# Altium schematic sheet Microcontroller.SchDoc
size 279 x 215 mm; Author: Riley Peterson; Revision: 0; SheetNumber: 2; SheetTotal: 3
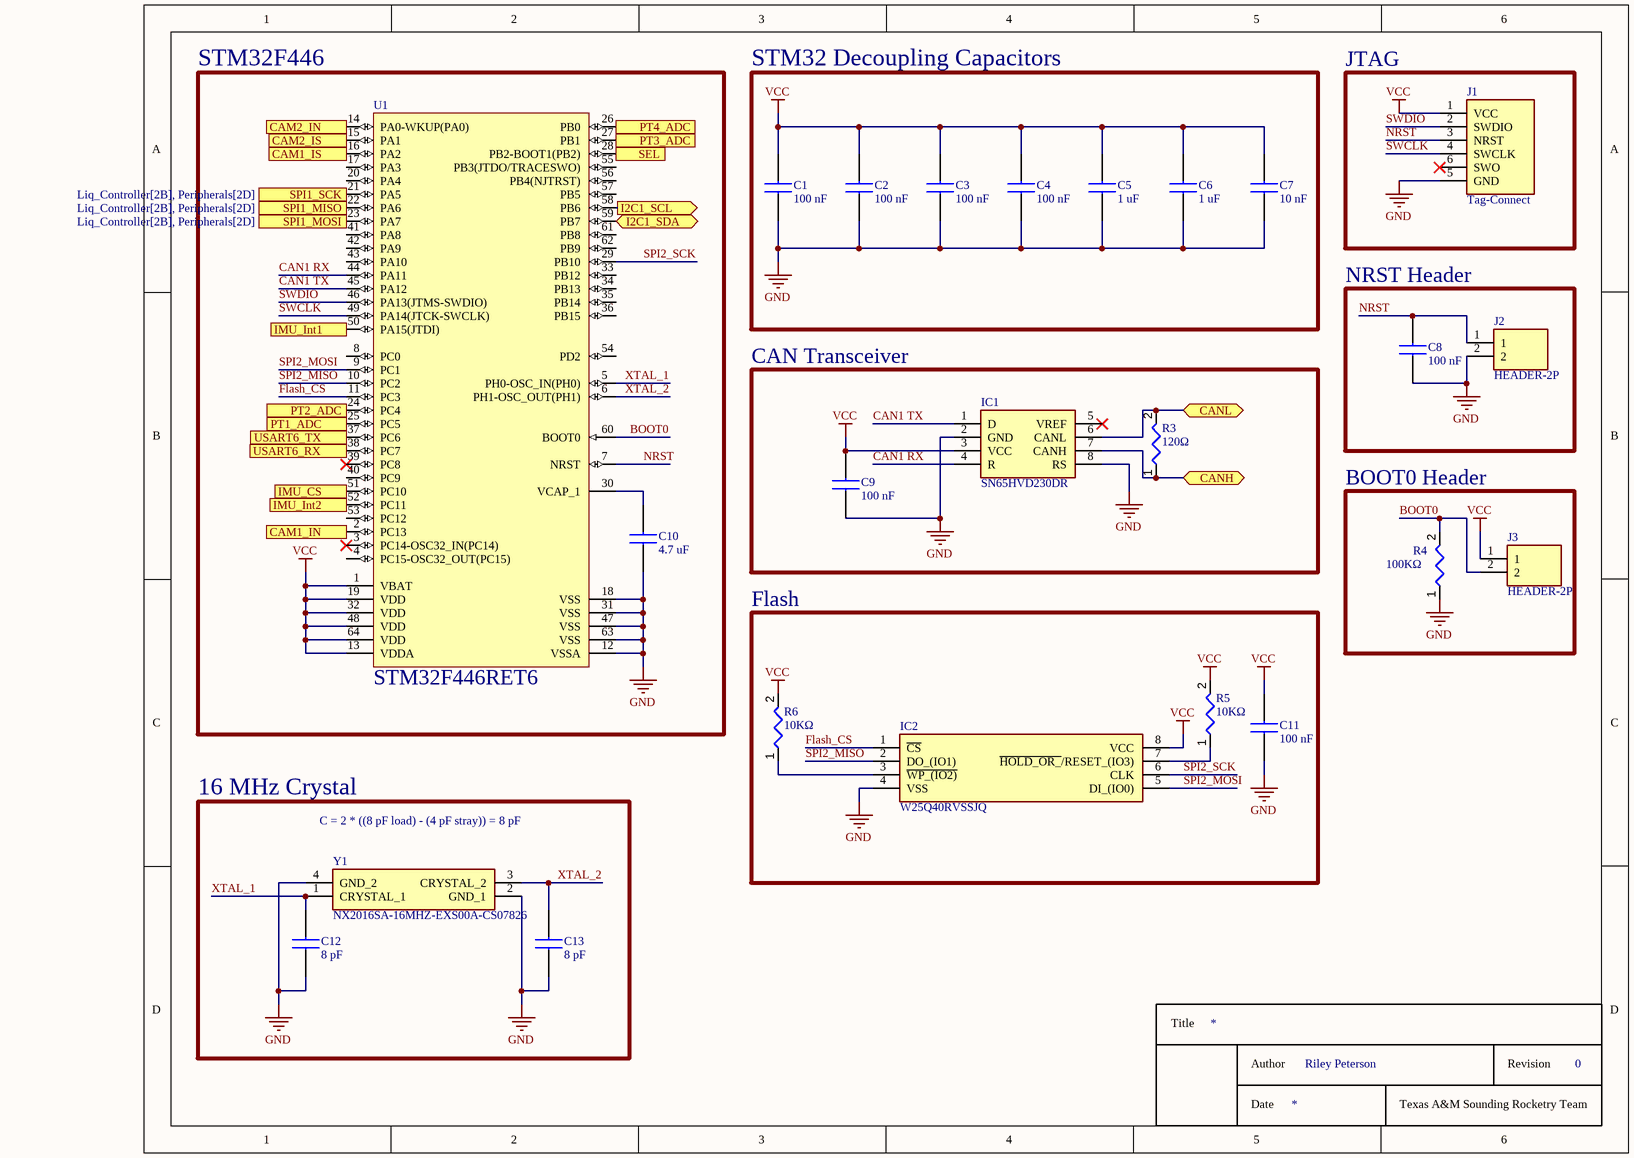
[diagram p0: Microcontroller.SchDoc]

## Parts
C1  100 nF  [CAP_0603]
C2  100 nF  [CAP_0603]
C3  100 nF  [CAP_0603]
C4  100 nF  [CAP_0603]
C5  1 uF  [CAP_0603]
C6  1 uF  [CAP_0603]
C7  10 nF  [CAP_0603]
C8  100 nF  [CAP_0603]
C9  100 nF  [CAP_0603]
C10  4.7 uF  [CAP_0603]
C11  100 nF  [CAP_0603]
C12  8 pF  [CAP_0603]
C13  8 pF  [CAP_0603]
IC1  SN65HVD230DR  [SOT127P600X175-8N]
IC2  W25Q40RVSSJQ  [SOIC127P790X216-8N]
J1  Tag-Connect  [TC2030-MCP]
J2  HEADER-2P  [HDRV2W110P0X254_1X2_508X254X854P]
J3  HEADER-2P  [HDRV2W110P0X254_1X2_508X254X854P]
R3  120Ω  [RES_0603]
R4  100KΩ  [RES_0603]
R5  10KΩ  [RES_0603]
R6  10KΩ  [RES_0603]
U1  STM32F446RET6  [QFP50P1200X1200X160-64N]
Y1  NX2016SA-16MHZ-EXS00A-CS07826  [NX2016SA16MHZEXS00ACS07826]

## Blocks framed on the sheet
STM32F446: C10 U1
STM32 Decoupling Capacitors: C1-C7
JTAG: J1
NRST Header: C8 J2
CAN Transceiver: C9 IC1 R3
BOOT0 Header: J3 R4
Flash: C11 IC2 R5 R6
16 MHz Crystal: C12 C13 Y1

## Ports
CAM1_IN (out), CAM1_IS (in), CAM2_IN (out), CAM2_IS (in), CANH (bidir, see Liq_Controller[2B], Peripherals[6B]), CANL (bidir, see Liq_Controller[2B], Peripherals[6B]), I2C1_SCL (out, see Liq_Controller[2A], Peripherals[5B]), I2C1_SDA (bidir, see Liq_Controller[2A], Peripherals[5B]), IMU_CS (out, see Liq_Controller[2B], Peripherals[2D]), IMU_Int1 (in, see Liq_Controller[2B], Peripherals[2D]), IMU_Int2 (in, see Liq_Controller[2B], Peripherals[1D]), PT1_ADC (in, see Liq_Controller[2B], Peripherals[6C]), PT2_ADC (in, see Liq_Controller[2B], Peripherals[6D]), PT3_ADC (in, see Liq_Controller[2B], Peripherals[4C]), PT4_ADC (in, see Liq_Controller[2B], Peripherals[4C]), SEL (in, see Liq_Controller[2B], Peripherals[4C]), SPI1_MISO (in, see Liq_Controller[2B], Peripherals[2D]), SPI1_MOSI (out, see Liq_Controller[2B], Peripherals[2D]), SPI1_SCK (out, see Liq_Controller[2B], Peripherals[2D]), USART6_RX (in, see Liq_Controller[2B], Peripherals[6A]), USART6_TX (out, see Liq_Controller[2B], Peripherals[6A])

## Nets
GND: C1.1 C2.1 C3.1 C4.1 C5.1 C6.1 C7.2 C8.1 C9.1 C10.2 C11.1 C12.1 C13.1 IC1.2(GND) IC1.8(RS) IC2.4(VSS) J1.5(GND) J2.2 R4.1 U1.12(VSSA) U1.18(VSS) U1.31(VSS) U1.47(VSS) U1.63(VSS) Y1.2(GND_1) Y1.4(GND_2)
VCC: C1.2 C2.2 C3.2 C4.2 C5.2 C6.2 C7.1 C9.2 C11.2 IC1.3(VCC) IC2.8(VCC) J1.1(VCC) J3.1 R5.2 R6.2 U1.1(VBAT) U1.13(VDDA) U1.19(VDD) U1.32(VDD) U1.48(VDD) U1.64(VDD)
BOOT0: J3.2 R4.2 U1.60(BOOT0)
CAM1_IN: U1.2(PC13) ; port CAM1_IN
CAM1_IS: U1.16(PA2) ; port CAM1_IS
CAM2_IN: U1.14(PA0-WKUP(PA0)) ; port CAM2_IN
CAM2_IS: U1.15(PA1) ; port CAM2_IS
CAN1 RX: IC1.4(R) U1.44(PA11)
CAN1 TX: IC1.1(D) U1.45(PA12)
CANH: IC1.7(CANH) R3.1 ; port CANH
CANL: IC1.6(CANL) R3.2 ; port CANL
Flash_CS: IC2.1(~{CS}) U1.11(PC3)
I2C1_SCL: U1.58(PB6) ; port I2C1_SCL
I2C1_SDA: U1.59(PB7) ; port I2C1_SDA
IMU_CS: U1.51(PC10) ; port IMU_CS
IMU_Int1: U1.50(PA15(JTDI)) ; port IMU_Int1
IMU_Int2: U1.52(PC11) ; port IMU_Int2
NRST: C8.2 J1.3(NRST) J2.1 U1.7(NRST)
PT1_ADC: U1.25(PC5) ; port PT1_ADC
PT2_ADC: U1.24(PC4) ; port PT2_ADC
PT3_ADC: U1.27(PB1) ; port PT3_ADC
PT4_ADC: U1.26(PB0) ; port PT4_ADC
SEL: U1.28(PB2-BOOT1(PB2)) ; port SEL
SPI1_MISO: U1.22(PA6) ; port SPI1_MISO
SPI1_MOSI: U1.23(PA7) ; port SPI1_MOSI
SPI1_SCK: U1.21(PA5) ; port SPI1_SCK
SPI2_MISO: IC2.2(DO_(IO1)) U1.10(PC2)
SPI2_MOSI: IC2.5(DI_(IO0)) U1.9(PC1)
SPI2_SCK: IC2.6(CLK) U1.29(PB10)
SWCLK: J1.4(SWCLK) U1.49(PA14(JTCK-SWCLK))
SWDIO: J1.2(SWDIO) U1.46(PA13(JTMS-SWDIO))
USART6_RX: U1.38(PC7) ; port USART6_RX
USART6_TX: U1.37(PC6) ; port USART6_TX
XTAL_1: C12.2 U1.5(PH0-OSC_IN(PH0)) Y1.1(CRYSTAL_1)
XTAL_2: C13.2 U1.6(PH1-OSC_OUT(PH1)) Y1.3(CRYSTAL_2)
NetC10_1: C10.1 U1.30(VCAP_1)
NetIC2_3: IC2.3(~{WP_(IO2)}) R6.1
NetIC2_7: IC2.7(~{HOLD_OR_}/RESET_(IO3)) R5.1

Not connected (* = marked no-connect by the designer): IC1 5(VREF)*; J1 6(SWO)*; U1 3(PC14-OSC32_IN(PC14))* 4(PC15-OSC32_OUT(PC15)) 8(PC0) 17(PA3) 20(PA4) 33(PB12) 34(PB13) 35(PB14) 36(PB15) 39(PC8)* 40(PC9) 41(PA8) 42(PA9) 43(PA10) 53(PC12) 54(PD2) 55(PB3(JTDO/TRACESWO)) 56(PB4(NJTRST)) 57(PB5) 61(PB8) 62(PB9)

## Notes on the sheet
- C = 2 * ((8 pF load) - (4 pF stray)) = 8 pF
- Title
- Author
- Date
- Texas A&M Sounding Rocketry Team
- Revision

## Library data of the parts
C1-C4 C8 C9 = 100 nF Capacitor, 0603: Multilayer Ceramic Capacitors MLCC - SMD/SMT KGM15BR71H104JT NEW GLOBAL PN 50V 0.1uF A 581-KGM15BR71H104JT; Manufacturer 1: KYOCERA AVX; Manufacturer Part Number 1: 06035C104JAT2A; Tolerance: 5%; Value: 100 nF; Voltage: 50 V; Package: 0603; Library Ref: Capacitor_BASE; Design Item ID: 100 nF Capacitor, 0603; Supplier 1: Mouser; Supplier Part Number 1: 581-06035C104JAT2A
C5 C6 = 1 uF Capacitor, 0603: Multilayer Ceramic Capacitors MLCC - SMD/SMT KGM15BR71H224JT NEW GLOBAL PN 50V 0.22uF A 581-KGM15BR71H224JT; Manufacturer 1: KYOCERA AVX; Manufacturer Part Number 1: 06033C105KAT2A; Tolerance: 10%; Voltage: 25 V; Value: 1 uF; Package: 0603; Library Ref: Capacitor_BASE; Design Item ID: 1 uF Capacitor, 0603; Supplier 1: Mouser; Supplier Part Number 1: 581-06033C105KAT2A
C7 = 10 nF Capacitor, 0603: Multilayer Ceramic Capacitors MLCC - SMD/SMT KGM15AR71H103JM NEW GLOBAL PN 50V 0.01uF A 581-KGM15AR71H103JM; Manufacturer 1: KYOCERA AVX; Manufacturer Part Number 1: 06035C103JAT4A; Tolerance: 5%; Value: 10 nF; Voltage: 50 V; Package: 0603; Library Ref: Capacitor_BASE; Design Item ID: 10 nF Capacitor, 0603; Supplier 1: Mouser; Supplier Part Number 1: 581-06035C103JAT4A
C10 = 4.7 uF Capacitor, 0603: Multilayer Ceramic Capacitors MLCC - SMD/SMT KGM15BR71H224JT NEW GLOBAL PN 50V 0.22uF A 581-KGM15BR71H224JT; Manufacturer 1: KYOCERA AVX; Manufacturer Part Number 1: 06033D475KAT2A; Tolerance: 10%; Voltage: 25 V; Value: 4.7 uF; Package: 0603; Library Ref: Capacitor_BASE; Design Item ID: 4.7 uF Capacitor, 0603; Supplier 1: Mouser; Supplier Part Number 1: 581-06033D475KAT2A
C11 = 100 nF Capacitor, 0603: Multilayer Ceramic Capacitors MLCC - SMD/SMT KGM15BR71H104JT NEW GLOBAL PN 50V 0.1uF A 581-KGM15BR71H104JT; Manufacturer 1: KYOCERA AVX; Manufacturer Part Number 1: 06035C104JAT2A; MPN: 581-06035C104JAT2A; Tolerance: 5%; Value: 100 nF; Voltage: 50 V; Package: 0603; Library Ref: Capacitor_BASE; Design Item ID: 100 nF Capacitor, 0603; Supplier 1: Mouser
C12 C13 = 8 pF Capacitor, 0603: Multilayer Ceramic Capacitors MLCC - SMD/SMT 50V 8pF C0G 0603 5%; Manufacturer 1: KYOCERA AVX; Manufacturer Part Number 1: 06035A8R0JAT2A; Value: 8 pF; Tolerance: 5%; Voltage: 50 V; Package: 0603; Library Ref: Capacitor_BASE; Design Item ID: 8 pF Capacitor, 0603; Supplier 1: Mouser; Supplier Part Number 1: 581-06035A8R0JAT2A
IC1 = SN65HVD230DR: CAN Transceiver; Manufacturer_Name: Texas Instruments; Datasheet Link: http://www.ti.com/lit/gpn/sn65hvd230; Height: 1.75mm; Manufacturer_Part_Number: SN65HVD230DR; Mouser Part Number: 595-SN65HVD230DR; Mouser Price/Stock: https://www.mouser.co.uk/ProductDetail/Texas-Instruments/SN65HVD230DR?qs=QViXGNcIEAtifeQR3pYVUQ%3D%3D; Arrow Part Number: SN65HVD230DR; Arrow Price/Stock: https://www.arrow.com/en/products/sn65hvd230dr/texas-instruments?utm_currency=USD&region=nac
IC2 = W25Q40RVSSJQ: 4 Mbit NOR Flash; Manufacturer_Name: Winbond; MPN: 454-W25Q40RVSSJQ; Datasheet Link: https://www.winbond.com/hq/search-resource-file.jsp?partNo=W25Q40RVSSJQ&type=datasheet; Height: 2.16mm; Manufacturer_Part_Number: W25Q40RVSSJQ
J1 = Tag-Connect: Tag-Connect Programming Connector
J2 J3 = HEADER-2P: Connector / 61300211121; Manufacturer_Name: Wurth Elektronik; Datasheet Link: https://componentsearchengine.com/Datasheets/2/61300211121.pdf; Height: 8.54mm; Manufacturer_Part_Number: 61300211121; Mouser Part Number: 710-61300211121; Mouser Price/Stock: https://www.mouser.co.uk/ProductDetail/Wurth-Elektronik/61300211121?qs=t4813l51qx%252B1A5GYDQxPlw%3D%3D
R3 = 120 Ohm Resistor: Thick Film Resistors - SMD General Purpose Chip Resistor 0603, 120Ohms, 1%, 1/10W; Manufacturer 1: YAGEO; Manufacturer Part Number 1: RC0603FR-07120RL; Tolerance: 0.01; Power: 0.1W; Value: 120Ω; Package: 0603; Library Ref: Resistor_BASE; Design Item ID: 120 Ohm Resistor; Supplier 1: Mouser; Supplier Part Number 1: 603-RC0603FR-07120RL
R4 = 100 KOhm Resistor: Thick Film Resistors - SMD General Purpose Chip Resistor 0603, 100kOhms, 1%, 1/10W; Manufacturer 1: YAGEO; Manufacturer Part Number 1: RC0603FR-07100KL; Tolerance: 0.01; Power: 0.1W; Value: 100KΩ; Package: 0603; Library Ref: Resistor_BASE; Design Item ID: 100 KOhm Resistor; Supplier 1: Mouser; Supplier Part Number 1: 603-RC0603FR-07100KL
R5 R6 = 10 KOhm Resistor: Thick Film Resistors - SMD General Purpose Chip Resistor 0603, 10kOhms, 1%, 1/10W; Manufacturer 1: YAGEO; Manufacturer Part Number 1: RC0603FR-0710KL; MPN: 603-RC0603FR-0710KL; Tolerance: 0.01; Power: 0.1W; Value: 10KΩ; Package: 0603; Library Ref: Resistor_BASE; Design Item ID: 10 KOhm Resistor; Supplier 1: Mouser
U1 = STM32F446RET6: ARM Cortex-M4 32-bit MCU+FPU, 512 KB Flash, 128 KB Internal RAM, 50 I/Os, 64-Pin LQFP, -40 to 85 degC, Tray; I/Os (High Current): 50; Supply Voltage(Vcc) min (V): 1.7; Operating Frequency(F) (Processor speed) (MHz): 180; D/A Converter: 2; Internal RAM Size (kB): 128; FLASH Size (Prog) (kB): 512; Core: ARM Cortex-M4; ComponentLink1Description: Manufacturer URL; Package Reference: 64-Pin Low-profile Quad Flat Package, Body 10 x 10 mm, Pitch 0.5 mm; ComponentLink2URL: http://www.st.com/st-web-ui/static/active/en/resource/technical/document/datasheet/DM00141306.pdf; Packing: Tray; DatasheetVersion: Rev. 6; ComponentLink1URL: http://www.st.com/; ComponentLink2Description: Datasheet; Package Description: LQFP64; Mounting Technology: Surface Mount
Y1 = NX2016SA-16MHZ-EXS00A-CS07826: Crystal Oscillator; Manufacturer_Name: NDK; Datasheet Link: https://www.ndk.com/images/products/catalog/c_NX2016SA_e.pdf; Height: 0.5mm; Manufacturer_Part_Number: NX2016SA-16MHZ-EXS00A-CS07826; Mouser Part Number: 344-MHZEXS00ACS07826; Mouser Price/Stock: https://www.mouser.co.uk/ProductDetail/NDK/NX2016SA-16MHZ-EXS00A-CS07826?qs=%252BXxaIXUDbq1kHvfpfcpbvQ%3D%3D; Supplier 1: Mouser; Supplier Part Number 1: 344-MHZEXS00ACS07826